# Altium project stm_debugger.PrjPcb
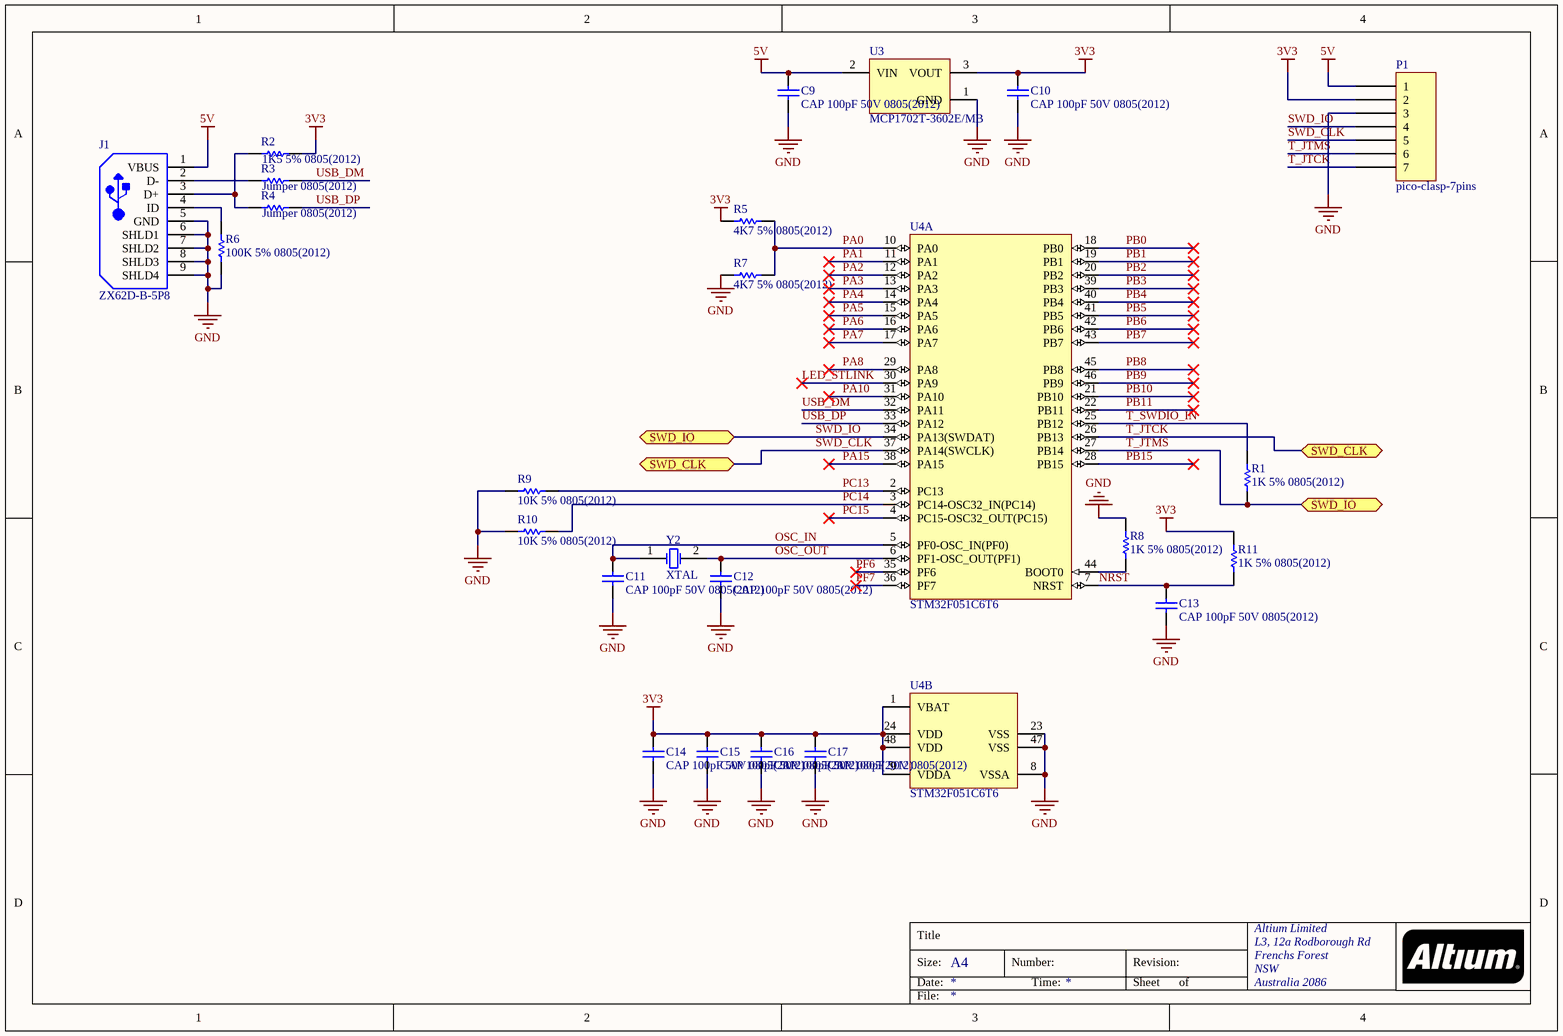
[diagram p0: STM32f051C6T6_debugger.SchDoc]
1 sheet, 25 parts. Net scope: flat (ports and power ports of the same name join across sheets).
Board file: STM32f051C6T6_debugger.PcbDoc

## Sheet STM32f051C6T6_debugger.SchDoc
size A4; Organization: Altium Limited; Address1: L3, 12a Rodborough Rd; Address2: Frenchs Forest; Address3: NSW; Address4: Australia 2086

### Parts
C9  CAP 100pF 50V 0805(2012)  [CAPC0805(2012)145_N]
C10  CAP 100pF 50V 0805(2012)  [CAPC0805(2012)145_N]
C11  CAP 100pF 50V 0805(2012)  [CAPC0805(2012)145_N]
C12  CAP 100pF 50V 0805(2012)  [CAPC0805(2012)145_N]
C13  CAP 100pF 50V 0805(2012)  [CAPC0805(2012)145_N]
C14  CAP 100pF 50V 0805(2012)  [CAPC0805(2012)145_N]
C15  CAP 100pF 50V 0805(2012)  [CAPC0805(2012)145_N]
C16  CAP 100pF 50V 0805(2012)  [CAPC0805(2012)145_N]
C17  CAP 100pF 50V 0805(2012)  [CAPC0805(2012)145_N]
J1  ZX62D-B-5P8  [HIRO-ZX62D-B-5P8_V]
P1  pico-clasp-7pins  [7 pins pico-clasp]
R1  1K 5% 0805(2012)  [RESC0805(2012)_L]
R2  1K5 5% 0805(2012)  [RESC0805(2012)_L]
R3  Jumper 0805(2012)  [RESC0805(2012)_N]
R4  Jumper 0805(2012)  [RESC0805(2012)_N]
R5  4K7 5% 0805(2012)  [RESC0805(2012)_N]
R6  100K 5% 0805(2012)  [RESC0805(2012)_L]
R7  4K7 5% 0805(2012)  [RESC0805(2012)_N]
R8  1K 5% 0805(2012)  [RESC0805(2012)_L]
R9  10K 5% 0805(2012)  [RESC0805(2012)_L]
R10  10K 5% 0805(2012)  [RESC0805(2012)_L]
R11  1K 5% 0805(2012)  [RESC0805(2012)_L]
U3  MCP1702T-3602E/MB  [SOT-89-MB3_M]
U4  STM32F051C6T6  [STM-LQFP48_M]  (parts A,B of 2)
Y2  XTAL  [R38]

### Ports
SWD_CLK, SWD_CLK (bidir), SWD_IO, SWD_IO (bidir)

### Nets
3V3: C10.2 C14.2 C15.2 C16.2 C17.2 P1.2 R2.2 R5.2 R11.2 U3.3(VOUT) U4.1(VBAT) U4.9(VDDA) U4.24(VDD) U4.48(VDD)
5V: C9.2 J1.1(VBUS) P1.1 U3.2(VIN)
GND: C9.1 C10.1 C11.1 C12.1 C13.1 C14.1 C15.1 C16.1 C17.1 J1.5(GND) J1.6(SHLD1) J1.7(SHLD2) J1.8(SHLD3) J1.9(SHLD4) P1.3 R6.1 R7.1 R8.2 R9.1 R10.1 U3.1(GND) U4.8(VSSA) U4.23(VSS) U4.47(VSS)
LED_STLINK: U4.30(PA9)
NRST: C13.2 R11.1 U4.7(NRST)
OSC_IN: C11.2 U4.5(PF0-OSC_IN(PF0)) Y2.1(OSC1)
OSC_OUT: C12.2 U4.6(PF1-OSC_OUT(PF1)) Y2.2(OSC2)
PA0: R5.1 R7.2 U4.10(PA0)
PA1: U4.11(PA1)
PA2: U4.12(PA2)
PA3: U4.13(PA3)
PA4: U4.14(PA4)
PA5: U4.15(PA5)
PA6: U4.16(PA6)
PA7: U4.17(PA7)
PA8: U4.29(PA8)
PA10: U4.31(PA10)
PA15: U4.38(PA15)
PB0: U4.18(PB0)
PB1: U4.19(PB1)
PB2: U4.20(PB2)
PB3: U4.39(PB3)
PB4: U4.40(PB4)
PB5: U4.41(PB5)
PB6: U4.42(PB6)
PB7: U4.43(PB7)
PB8: U4.45(PB8)
PB9: U4.46(PB9)
PB10: U4.21(PB10)
PB11: U4.22(PB11)
PB15: U4.28(PB15)
PC13: R9.2 U4.2(PC13)
PC14: R10.2 U4.3(PC14-OSC32_IN(PC14))
PC15: U4.4(PC15-OSC32_OUT(PC15))
PF6: U4.35(PF6)
PF7: U4.36(PF7)
SWD_CLK: P1.5 P1.7 U4.26(PB13) U4.37(PA14(SWCLK)) ; port SWD_CLK  [also labelled T_JTCK]
SWD_IO: P1.4 P1.6 R1.1 U4.27(PB14) U4.34(PA13(SWDAT)) ; port SWD_IO  [also labelled T_JTMS]
T_SWDIO_IN: R1.2 U4.25(PB12)
USB_DM: R3.2 U4.32(PA11)
USB_DP: R4.2 U4.33(PA12)
NetJ1_2: J1.2(D-) R3.1
NetJ1_3: J1.3(D+) R2.1 R4.1
NetJ1_4: J1.4(ID) R6.2
NetR8_1: R8.1 U4.44(BOOT0)

### Notes on the sheet
- Title
- Size:
- Date:
- A4
- Number:
- Time:
- Revision:
- Sheet
- of
- File:

### Library data of the parts
C9-C17 = CMP-1036-01961-1: CAP 100pF 50V ±5% 0805 (2012 Metric) Thickness 1.45mm SMD; Tolerance: Â±5%; Case-EIA: 0805; Case-Metric: 2012; Value: 100pF; Max Thickness: 1.45 mm; Rated Voltage: 50 V; Technology: SMT
J1 = CMP-0029-00002-1: Right Angle Receptacle Connector, Micro USB, 30 V(AC), -30 to 85 degC, 5-Pin SMD, RoHS, Tape and Reel; Capacitance: 1 uF; Tolerance: 10%; ESR: 7.5 Ohm; Voltage Rating: 35 V; PackageDescription: USB Connector, 5 Position Surface Mount, Length 8 mm, Height 2.65 mm; DatasheetVersion: Aug-16; REACH SVHC: No SVHC; Package Quantity: 2000; ComponentLink1Description: Manufacturer URL; ComponentLink2URL: https://www.hirose.com/product/en/download_file/key_name/ZX62D-B-5P8/category/Catalog/doc_file_id/31704/?file_category_id=5&item_id=02420034000&is_series=; Length: 3.2 mm; ComponentLink1URL: https://www.hirose.com; Radiation Hardening: No; Height: 1.8 mm; Max Operating Temperature: 125degC; Weight: 0.000571 oz; Min Operating Temperature: -55degC; ComponentLink3Description: Package Specification; Width: 1.6 mm; Case Code (Metric): 3216; Mount: Surface Mount; ComponentLink2Description: Datasheet; Case Code (Imperial): 1206; ComponentLink3URL: https://www.hirose.com/product/en/download_file/key_name/ZX62D-B-5P8/category/Drawing%20(2D)/doc_file_id/36535/?file_category_id=6&item_id=02420034000&is_series=; Pins: 2; Resistance: 7.5 Ohm; Packaging: Tape and Reel; RoHSCompliant: True; Voltage Rating (DC): 35 V; Case/Package: 1206; PackageReference: ZX62D-B-5P8
P1 = pico-clasp-7: 7 pins pico clasp
R1 R8-R11 = CMP-1013-00098-1: 10K 0.125W 5% 0805 (2012 Metric)  SMD; Case-EIA: 0805; Case-Metric: 2012; Value: 10000.00 Ohm; Power: 0.125 W; Technology: SMT; Tolerance: 5 %
R2 = CMP-1013-00078-1: 1K5 0.125W 5% 0805 (2012 Metric)  SMD; Case-EIA: 0805; Value: 1500.00 Ohm; Case-Metric: 2012; Power: 0.125 W; Technology: SMT; Tolerance: 5 %
R3 R4 = CMP-1013-00001-1: Jumper 0805 (2012 Metric); Case-EIA: 0805; Value: 0.00 Ohm; Tolerance: None; Case-Metric: 2012; Technology: SMT; Power: None
R5 R7 = CMP-1013-00090-1: 4K7 0.125W 5% 0805 (2012 Metric)  SMD; Case-EIA: 0805; Value: 4700.00 Ohm; Case-Metric: 2012; Power: 0.125 W; Tolerance: 5 %; Technology: SMT
R6 = CMP-1013-00122-1: 100K 0.125W 5% 0805 (2012 Metric)  SMD; Case-Metric: 2012; Value: 100000.00 Ohm; Case-EIA: 0805; Tolerance: 5 %; Technology: SMT; Power: 0.125 W
U3 = CMP-0136-00851-1: 250 mA Low Quiescent Current LDO Regulator, 3-Pin SOT-89, Extended Temperature, Tape and Reel; PackageReference: SOT-89-MB3; DatasheetVersion: revD, Jun-2009; PackageDescription: 3-Lead Plastic Small Outline Transistor Header (MB) [SOT-89]; PackageVersion: revBB, Aug-2009; Code_IPC: SOT89
U4 = CMP-0304-00011-3: ARM Cortex-M0 32-bit MCU, 32 KB Flash, 4 KB Internal RAM, 39 I/Os, 48-pin LQFP, -40 to 85 degC, Tray; Internal RAM Size (kB): 4; Operating Frequency(F) (Processor speed) (MHz): 48; FLASH Size (Prog) (kB): 32; Supply Voltage(Vcc) min (V): 2; I/Os (High Current): 39; ComponentLink3URL: http://www.st.com/st-web-ui/static/active/en/resource/technical/document/datasheet/DM00058181.pdf; Mounting Technology: Surface Mount; PackageDescription: 48-Pin Low Profile Quad Flat Package, 7 x 7 mm Body, 0.5 mm Pitch; PackageReference: LQFP48; ComponentLink1Description: Manufacturer URL; ComponentLink1URL: http://www.st.com/web/en/home.html; Core: ARM Cortex-M0; ComponentLink2URL: http://www.st.com/st-web-ui/static/active/en/resource/technical/document/datasheet/DM00039193.pdf; PackageVersion: Rev. 6, 06/2013; ComponentLink2Description: Datasheet; PartNumber: STM32F051C6T6; ComponentLink3Description: Package Specification; Packing: Tray; DatasheetVersion: Rev. 3
Y2 = XTAL: Crystal Oscillator; Published: 8-Jun-2000; LatestRevisionDate: 17-Jul-2002; LatestRevisionNote: Re-released for DXP Platform.; PackageReference: R38; Publisher: Altium Limited; PackageDescription: Crystal, Thru-Hole; 2 Leads; Body 3.1 x 8.2 mm (Dia.xH)